# Altium project ECE295 Test Board.PrjPcb
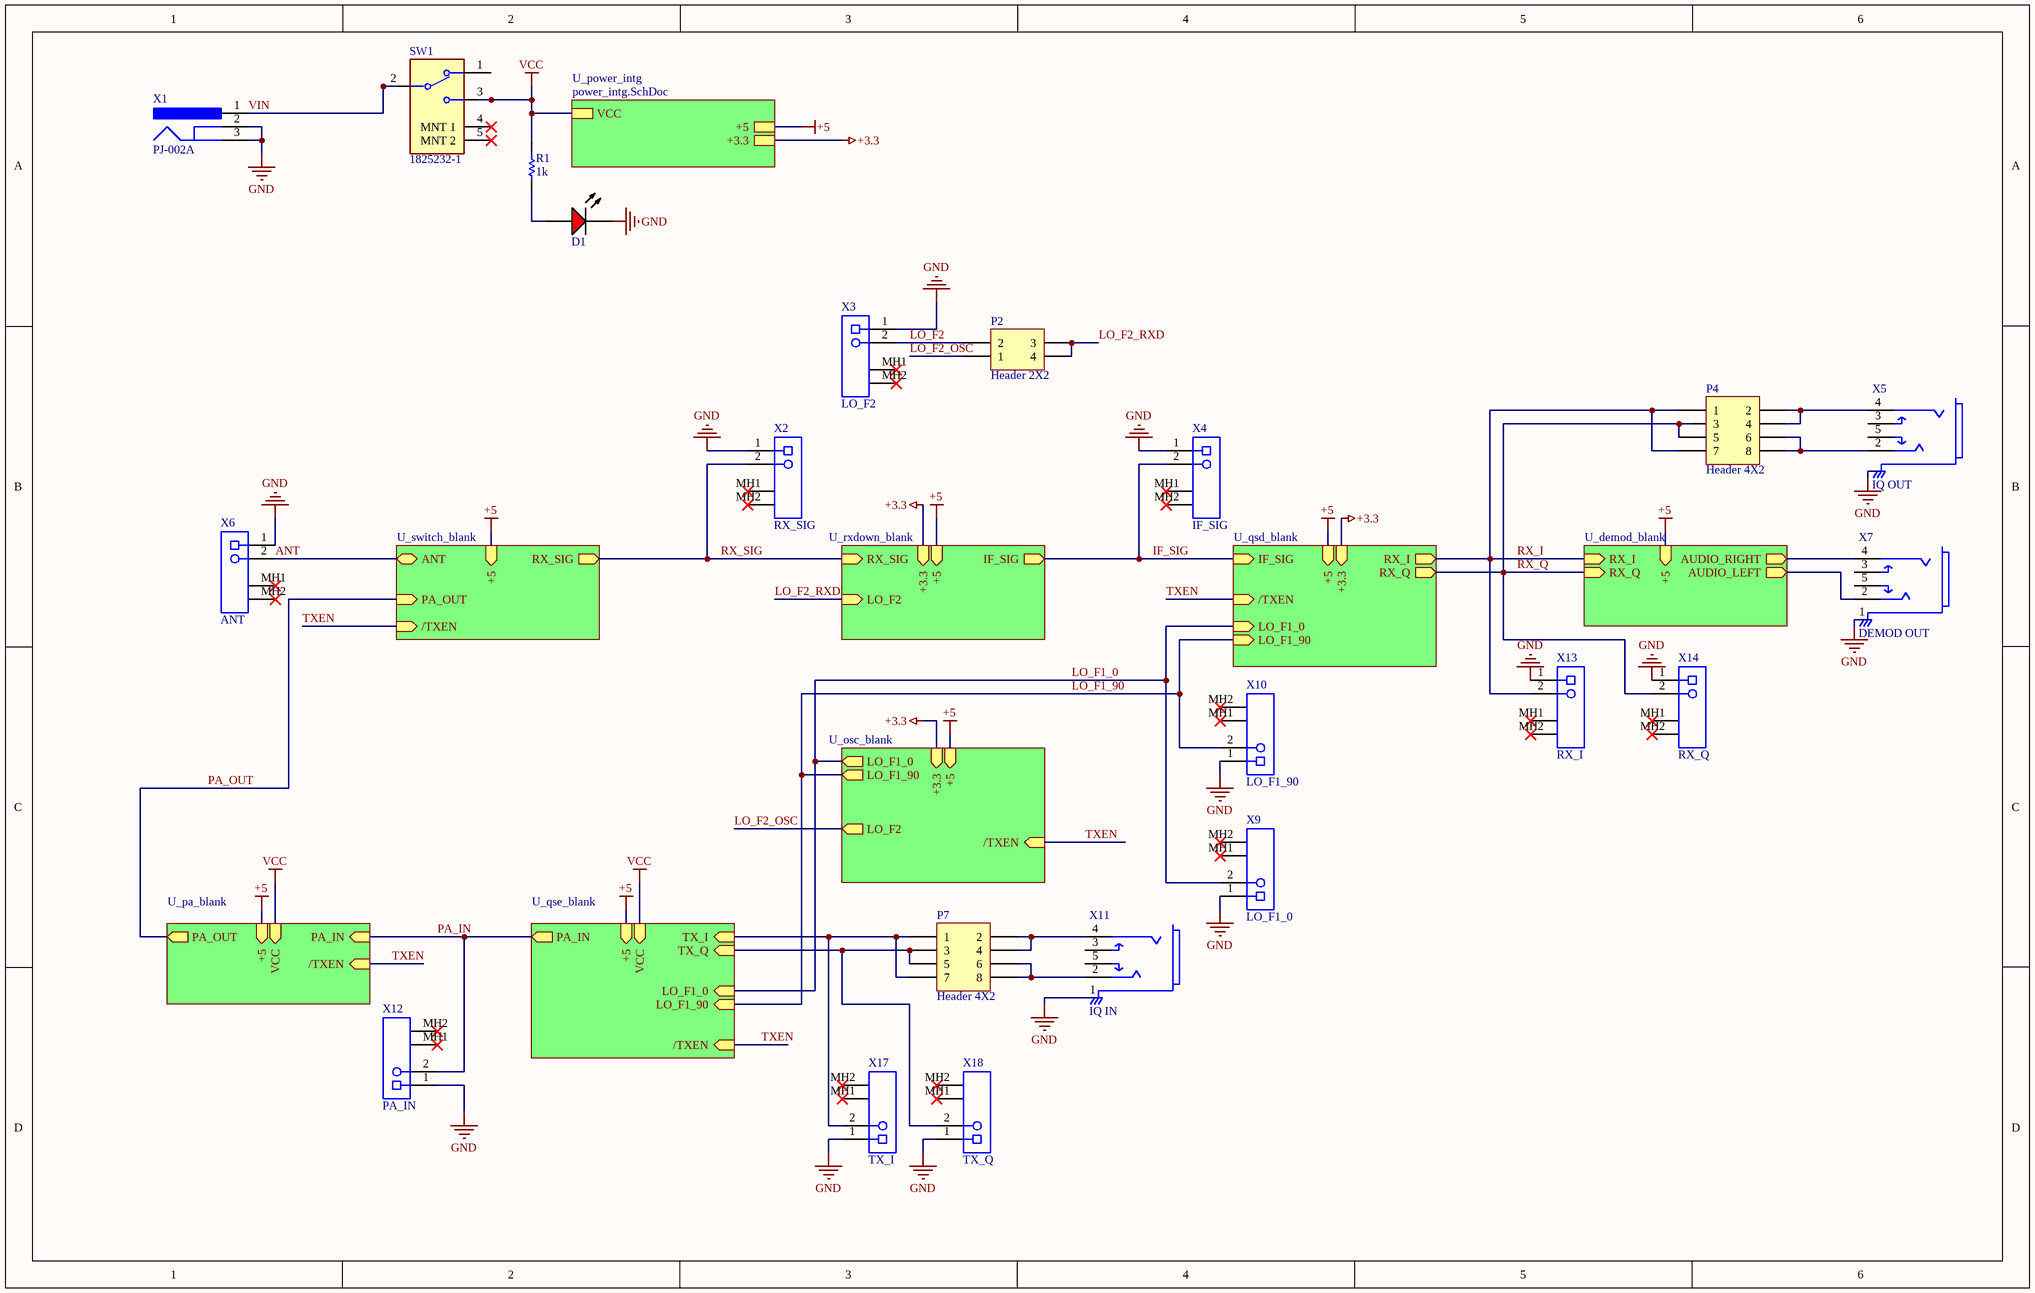
[diagram p0: top_blank.SchDoc]
9 sheets, 48 parts. Net scope: hierarchical (ports join the sheet entries above them; power ports are global).
Board files: top_blank.PcbDoc, demod_blank.PcbDoc, qsd_blank.PcbDoc, qse_blank.PcbDoc, rxdown_blank.PcbDoc, pa_blank.PcbDoc, switch_blank.PcbDoc, osc_blank.PcbDoc
Sheets:
  top_blank.SchDoc
    U_switch_blank = switch_blank.SchDoc
    U_rxdown_blank = rxdown_blank.SchDoc
    U_qsd_blank = qsd_blank.SchDoc
    U_demod_blank = demod_blank.SchDoc
    U_osc_blank = osc_blank.SchDoc
    U_pa_blank = pa_blank.SchDoc
    U_qse_blank = qse_blank.SchDoc
    U_power_intg = power_intg.SchDoc

## Sheet top_blank.SchDoc
size 381 x 241 mm; SheetNumber: 1; SheetTotal: 9

### Parts
D1  HLMP-3301  [AVAG-HLMP-3301-2]  (value not drawn)
P2  Header 2X2  [HDR2X2]
P4  Header 4X2  [HDR2X4]
P7  Header 4X2  [HDR2X4]
R1  value 1k  [AXIAL-0.4]  (hidden comment: Res1)
SW1  1825232-1  [FP-1825232-1-MFG]
X1  PJ-002A  [CUI-PJ-002A_V]
X2  RX_SIG  [TECO-1-1337543-0_V]
X3  LO_F2  [TECO-1-1337543-0_V]
X4  IF_SIG  [TECO-1-1337543-0_V]
X5  IQ OUT  [FP-35RAPC4BV4-MFG]
X6  ANT  [TECO-1-1337543-0_V]
X7  DEMOD OUT  [FP-35RAPC4BV4-MFG]
X9  LO_F1_0  [TECO-1-1337543-0_V]
X10  LO_F1_90  [TECO-1-1337543-0_V]
X11  IQ IN  [FP-35RAPC4BV4-MFG]
X12  PA_IN  [TECO-1-1337543-0_V]
X13  RX_I  [TECO-1-1337543-0_V]
X14  RX_Q  [TECO-1-1337543-0_V]
X17  TX_I  [TECO-1-1337543-0_V]
X18  TX_Q  [TECO-1-1337543-0_V]

### Sub-sheets
U_demod_blank = demod_blank.SchDoc: AUDIO_LEFT (out), AUDIO_RIGHT (out), +5 (in), RX_Q (in), RX_I (in)
U_osc_blank = osc_blank.SchDoc: /TXEN (in), LO_F1_0 (out), LO_F1_90 (out), LO_F2 (out), +5 (in), +3.3 (in)
U_pa_blank = pa_blank.SchDoc: PA_IN (in), PA_OUT (out), /TXEN (in), +5 (in), VCC (in)
U_power_intg = power_intg.SchDoc: VCC, +3.3, +5
U_qsd_blank = qsd_blank.SchDoc: RX_I (out), RX_Q (out), IF_SIG (in), /TXEN (in), LO_F1_90 (in), LO_F1_0 (in), +5 (in), +3.3 (in)
U_qse_blank = qse_blank.SchDoc: TX_I (in), TX_Q (in), /TXEN (in), LO_F1_0 (in), LO_F1_90 (in), PA_IN (out), VCC (in), +5 (in)
U_rxdown_blank = rxdown_blank.SchDoc: IF_SIG (out), +5 (in), +3.3 (in), LO_F2 (in), RX_SIG (in)
U_switch_blank = switch_blank.SchDoc: ANT (bidir), RX_SIG (out), PA_OUT (in), /TXEN (in), +5 (in)

### Nets
+3.3: sheet U_rxdown_blank/+3.3, sheet U_qsd_blank/+3.3, sheet U_osc_blank/+3.3, sheet U_power_intg/+3.3
+5: sheet U_switch_blank/+5, sheet U_rxdown_blank/+5, sheet U_qsd_blank/+5, sheet U_demod_blank/+5, sheet U_osc_blank/+5, sheet U_pa_blank/+5, sheet U_qse_blank/+5, sheet U_power_intg/+5
GND: D1.1(K) X1.2 X1.3 X2.1 X3.1 X4.1 X5.1 X6.1 X7.1 X9.1 X10.1 X11.1 X12.1 X13.1 X14.1 X17.1 X18.1
VCC: R1.2 SW1.3 ; sheet U_pa_blank/VCC, sheet U_qse_blank/VCC, sheet U_power_intg/VCC
ANT: X6.2 ; sheet U_switch_blank/ANT
IF_SIG: X4.2 ; sheet U_rxdown_blank/IF_SIG, sheet U_qsd_blank/IF_SIG
LO_F1_0: X9.2 ; sheet U_qsd_blank/LO_F1_0, sheet U_osc_blank/LO_F1_0, sheet U_qse_blank/LO_F1_0
LO_F1_90: X10.2 ; sheet U_qsd_blank/LO_F1_90, sheet U_osc_blank/LO_F1_90, sheet U_qse_blank/LO_F1_90
LO_F2: P2.2 X3.2
LO_F2_OSC: P2.1 ; sheet U_osc_blank/LO_F2
LO_F2_RXD: P2.3 P2.4 ; sheet U_rxdown_blank/LO_F2
PA_IN: X12.2 ; sheet U_pa_blank/PA_IN, sheet U_qse_blank/PA_IN
PA_OUT: sheet U_switch_blank/PA_OUT, sheet U_pa_blank/PA_OUT
RX_I: P4.1 P4.7 X13.2 ; sheet U_qsd_blank/RX_I, sheet U_demod_blank/RX_I
RX_Q: P4.3 P4.5 X14.2 ; sheet U_qsd_blank/RX_Q, sheet U_demod_blank/RX_Q
RX_SIG: X2.2 ; sheet U_switch_blank/RX_SIG, sheet U_rxdown_blank/RX_SIG
TXEN: sheet U_switch_blank//TXEN, sheet U_qsd_blank//TXEN, sheet U_osc_blank//TXEN, sheet U_pa_blank//TXEN, sheet U_qse_blank//TXEN
VIN: SW1.2 X1.1
NetD1_2: D1.2(A) R1.1
NetJ8_1: X7.4 ; sheet U_demod_blank/AUDIO_RIGHT
NetJ8_2: X7.2 ; sheet U_demod_blank/AUDIO_LEFT
NetJ14_1: P7.1 P7.7 X17.2 ; sheet U_qse_blank/TX_I
NetJ14_2: P7.3 P7.5 X18.2 ; sheet U_qse_blank/TX_Q
NetP4_2: P4.2 P4.4 X5.4
NetP4_6: P4.6 P4.8 X5.2
NetP7_2: P7.2 P7.4 X11.4
NetP7_6: P7.6 P7.8 X11.2

Not connected (* = marked no-connect by the designer): SW1 1 4(MNT_1)* 5(MNT_2)*; X2 MH1* MH2*; X3 MH1* MH2*; X4 MH1* MH2*; X5 3 5; X6 MH1* MH2*; X7 3 5; X9 MH1* MH2*; X10 MH1* MH2*; X11 3 5; X12 MH1* MH2*; X13 MH1* MH2*; X14 MH1* MH2*; X17 MH1* MH2*; X18 MH1* MH2*

### Library data of the parts
D1 = CMP-2000-06411-1: T-1 3/4 (5 mm) Diffused LED Lamp, 1.9 V, -40 to 100 degC, 2-Pin THD, RoHS, Bulk; Manufacturer: Avago; Forward Current: 25mA; Forward Voltage: 2.4V; Peak Wavelength: 635nm; Shape Type: Circular; High Brightness: No; Main Category: StandardLED; Test Current (It): 10mA; Dominant Wave Length: 626nm; Number of  Elements: 1; Reverse Voltage: 5V; Chip Material: GaP; Product Height (mm): 9.19mm; Lens Type: ColoredDiffused; Viewing Angle: 60deg; Type: Uni-Color; Emitting Color: Red; Luminous Intensity: 5.4mcd; Power Dissipation: 85W; DELETED: Compliant; Product Depth (mm): 6.1mm; Package Description: 2-Pin Through Hole LED, Dia 5.85 mm; Mounting Technology: ThroughHole; Manufacturer URL: http://www.avagotech.com/; Package Type: T-13/4; Operating Temp Range: -40Cto100C; Datasheet URL: http://www.avagotech.com/docs/AV02-1558EN; Mounting: ThroughHole; Lens Dimensions: 5.08x5.08x8.3mm; Package Reference: HLMP-3301; Datasheet Version: 03/2015; Pin Count: 2; Packaging: TapeandReel; Operating Temperature Classification: Industrial; Lum Intensity: 5.4mcd; Rad Hardened: No; Product Length (mm): 6.1mm
P2 = Header 2X2: Header, 2-Pin, Dual row; LatestRevisionDate: 17-Jul-2002; LatestRevisionNote: Re-released for DXP Platform.; Publisher: Altium Limited
P4 P7 = Header 4X2: Header, 4-Pin, Dual row; LatestRevisionDate: 17-Jul-2002; LatestRevisionNote: Re-released for DXP Platform.; Publisher: Altium Limited
R1 = Res1: Resistor; Published: 8-Jun-2000; LatestRevisionDate: 17-Jul-2002; LatestRevisionNote: Re-released for DXP Platform.; PackageReference: AXIAL-0.3; Publisher: Altium Limited; PackageDescription: Axial Device, Thru-Hole; 2 Leads; 0.3 in Pin Spacing
SW1 = CMP-03405-000001-1: SWITCH SLIDE SPDT 200MA 30V; Manufacturer: TE Connectivity; Contact Current Rating: 0.2A; Contact Resistance: 20mΩ; Electromechanical Life: 10000Cycles; Operating Force: 200gf; Throw Configuration: SPDT; Manufacturer Part Number: 1825232-1; Temperature Range High: +70°C; Height: 3.7mm; ComponentLink2URL: https://www.te.com/commerce/DocumentDelivery/DDEController?Action=showdoc&DocId=Customer+Drawing%7F1825232%7FB2%7Fpdf%7FEnglish%7FENG_CD_1825232_B2.pdf%7F1825232-1; Mount: Through Hole; Mouser Description: Slide Switches SLIDE SWITCH SPDT Right Angle; Package: 1825232-1; Temperature: -20°C to +70°C; Automotive: No; ComponentLink2Description: Datasheet; Lead Free: Yes; Octopart: https://octopart.com/1825232-1-te+connectivity-45209882; Device Class L1: Electromechanical; Digikey Description: SWITCH SLIDE SPDT 200MA 30V; Device Class L3: Slide Switches; Device Class L2: Switches; Voltage Rating Dc: 30V; Temperature Range Low: -20°C; Category: Switch; RoHS: TRUE
X1 = CMP-2000-06895-1: Through Hole Right Angle DC Power Jack, 2.5 A, 2 mm Center Pin, 3 Position, -25 to 85 degC, RoHS, Bulk; Manufacturer: CUIInc.; Current Rating: 2.5A; Inside Contact Diameter: 2mm; Insulation Resistance: 50MOhms; Outside Contact Diameter: 6.5mm; Voltage Rating: 24V; Brand: CUI; Operating Temperature Range: -25Cto+85C; Mounting Technology: ThroughHole; Connector Type: DCPowerJack; Contact Material: Copper; Datasheet URL: http://www.cui.com/product/resource/pj-002a.pdf; Contact Gender: Male; Housing Material: PolybutyleneTerephthalate(PBT); Manufacturer URL: http://www.cui.com/; Package Reference: PJ-002A; Mounting Style: ThroughHole; Mounting Angle: Right; Product Category: DCPowerConnectors; Product: Jacks; Flammability Rating: UL94V-0; Contact Plating: Nickel; RoHS: True; Datasheet Version: Rev. 1.03, 04/2016; Package Description: 3-Pin Through Hole Device, Body 14.4 x 9 mm, Height 11 mm; Factory Pack Quantity: 500; Termination Style: ThroughHole
X2-X4 X6 X9 X10 X12-X14 X17 X18 = CMP-2000-05853-1: Female Connector, Pitch 2.54 mm, 1 x 2 Position, Height 15.8 mm, Tail Length 3.8 mm, / -55 to 85 degC, RoHS, Bulk; Manufacturer: TE Connectivity; Connector Body Style: RightAngleJack; Frequency Max: 4GHz; Coaxial Termination: Solder; Connector Mounting: PCBMount; SVHC: ToBeAdvised; Connector Type: BNCCoaxial; Impedance: 50ohm; Coaxial Cable Types: -; Manufacturer URL: http://www.te.com/; Package Reference: 1-1337543-0; Product Range: -; Datasheet URL: http://www.te.com/commerce/DocumentDelivery/DDEController?Action=showdoc&DocId=Customer+Drawing%7F1337543%7FG%7Fpdf%7FEnglish%7FENG_CD_1337543_G.pdf%7F1-1337543-0; Contact Plating: GoldPlatedContacts; Mounting Technology: ThroughHole; Package Description: Female Connector, Pitch 2.54 mm, 1 x 2 Position, Height 15.8 mm, Tail Length 3.8 mm; Contact Material: Brass; Datasheet Version: Rev. G, 12/2012
X5 X7 X11 = CMP-47983-000001-1: CONN JACK STEREO 3.5MM R/A; Manufacturer: Switchcraft; Obsolete Part: true; Manufacturer Part Number: 35RAPC4BV4; Conn Orientation: Right Angle; Number Of Contacts: 5; Contact Material: Silver; Device Class L1: Connectors; Height: 0.495inch; ComponentLink2URL: http://www.switchcraft.com/Drawings/35rapc__v4_cd.pdf; Category: Conn; Digikey Description: CONN JACK STEREO 3.5MM R/A; Automotive: No; ComponentLink2Description: Datasheet; Package: 35RAPC4BV4; Device Class L2: Audio / Video Connectors; Mouser Description: Phone Connectors 3.5MM VERT STEREO JK; RoHS: TRUE; Octopart: https://octopart.com/35rapc4bv4-switchcraft-223606; Lead Free: Yes; Device Class L3: unset

## Sheet switch_blank.SchDoc
size Letter; SheetNumber: 8; SheetTotal: 9
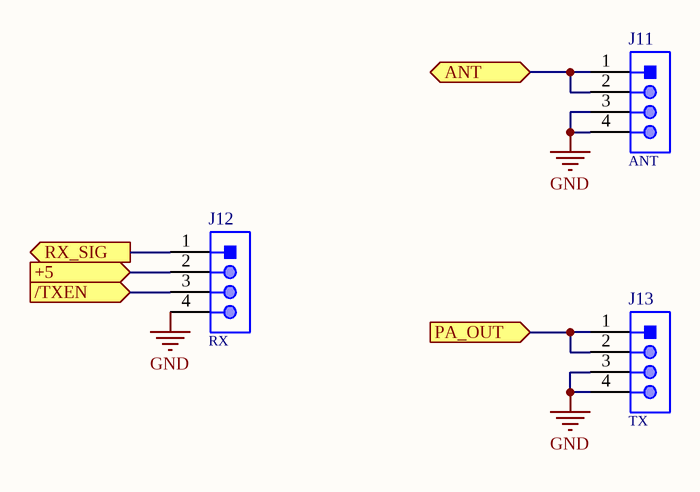
[diagram p1: switch_blank.SchDoc]

### Parts
J11  ANT  [61300411121]
J12  RX  [61300411121]
J13  TX  [61300411121]

### Ports
+5 (in), /TXEN (in), ANT (bidir), PA_OUT (in), RX_SIG (out)

### Nets
+5: J12.2 ; port +5
GND: J11.3 J11.4 J12.4 J13.3 J13.4
ANT: J11.1 J11.2 ; port ANT
PA_OUT: J13.1 J13.2 ; port PA_OUT
RX_SIG: J12.1 ; port RX_SIG
TXEN: J12.3 ; port /TXEN

### Library data of the parts
J11-J13 = CMP-1502-01064-1: THT Vertical Pin Header WR-PHD, Pitch 2.54 mm, Single Row, 4 pins; Manufacturer: Wurth Elektronik; Withstanding Voltage: 500VAC; Rated Current: 3A; Working Voltage: 250VAC; Pin Number: 4; Gender: Male; Contact Resistance: 20mOhm; Pitch: 2.54mm; Manufacturer URL: http://www.we-online.de; Operating Temperature: -40to105degC; Packaging: Bag; Mounting Technology: THT; Package Reference: 61300411121; Datasheet URL: https://katalog.we-online.de/em/datasheet/6130xx11121.pdf; Publisher: WurthElektronik; Part Number: 61300411121; Row Number: Single; Orientation: Vertical

## Sheet rxdown_blank.SchDoc
size Letter; SheetNumber: 9; SheetTotal: 9
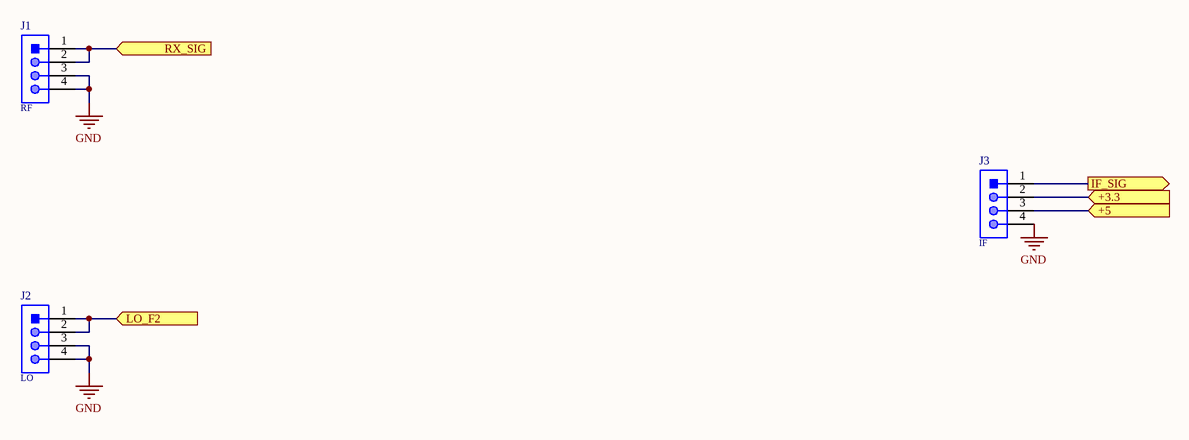
[diagram p2: rxdown_blank.SchDoc]

### Parts
J1  RF  [61300411121]
J2  LO  [61300411121]
J3  IF  [61300411121]

### Ports
+3.3 (in), +5 (in), IF_SIG (out), LO_F2 (in), RX_SIG (in)

### Nets
+3.3: J3.2 ; port +3.3
+5: J3.3 ; port +5
GND: J1.3 J1.4 J2.3 J2.4 J3.4
IF_SIG: J3.1 ; port IF_SIG
LO_F2_RXD: J2.1 J2.2 ; port LO_F2
RX_SIG: J1.1 J1.2 ; port RX_SIG

### Library data of the parts
J1-J3 = CMP-1502-01064-1: as J11 on sheet switch_blank; Manufacturer URL: http://www.we-online.de; Operating Temperature: -40to105degC; Packaging: Bag; Mounting Technology: THT; Package Reference: 61300411121; Datasheet URL: https://katalog.we-online.de/em/datasheet/6130xx11121.pdf; Publisher: WurthElektronik; Part Number: 61300411121; Row Number: Single; Orientation: Vertical

## Sheet qsd_blank.SchDoc
size Letter; SheetNumber: 7; SheetTotal: 9
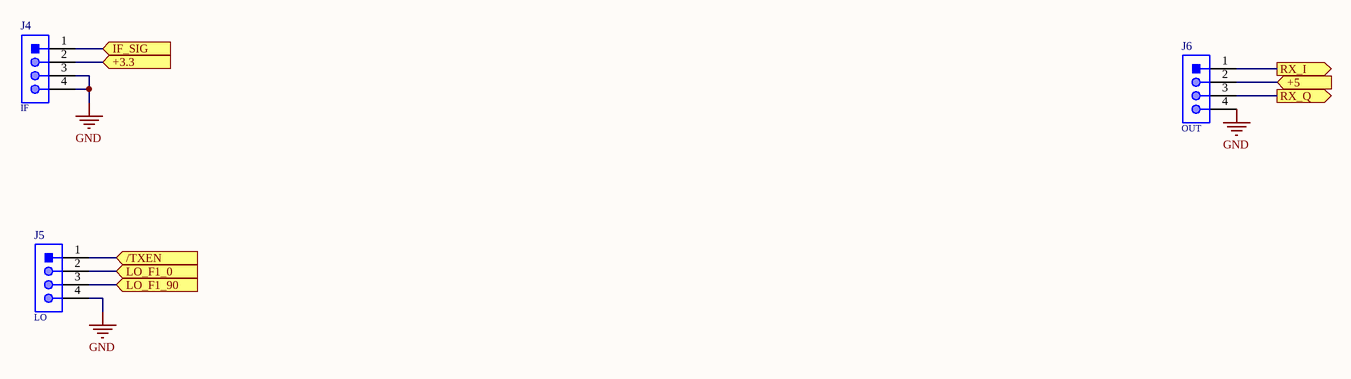
[diagram p3: qsd_blank.SchDoc]

### Parts
J4  IF  [61300411121]
J5  LO  [61300411121]
J6  OUT  [61300411121]

### Ports
+3.3 (in), +5 (in), /TXEN (in), IF_SIG (in), LO_F1_0 (in), LO_F1_90 (in), RX_I (out), RX_Q (out)

### Nets
+3.3: J4.2 ; port +3.3
+5: J6.2 ; port +5
GND: J4.3 J4.4 J5.4 J6.4
IF_SIG: J4.1 ; port IF_SIG
LO_F1_0: J5.2 ; port LO_F1_0
LO_F1_90: J5.3 ; port LO_F1_90
RX_I: J6.1 ; port RX_I
RX_Q: J6.3 ; port RX_Q
TXEN: J5.1 ; port /TXEN

### Library data of the parts
J4-J6 = CMP-1502-01064-1: as J11 on sheet switch_blank; Manufacturer URL: http://www.we-online.de; Operating Temperature: -40to105degC; Packaging: Bag; Mounting Technology: THT; Package Reference: 61300411121; Datasheet URL: https://katalog.we-online.de/em/datasheet/6130xx11121.pdf; Publisher: WurthElektronik; Part Number: 61300411121; Row Number: Single; Orientation: Vertical

## Sheet demod_blank.SchDoc
size Letter; SheetNumber: 13; SheetTotal: 13
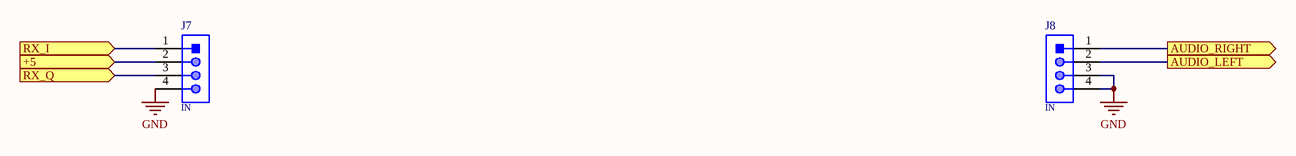
[diagram p4: demod_blank.SchDoc]

### Parts
J7  IN  [61300411121]
J8  IN  [61300411121]

### Ports
+5 (in), AUDIO_LEFT (out), AUDIO_RIGHT (out), RX_I (in), RX_Q (in)

### Nets
+5: J7.2 ; port +5
GND: J7.4 J8.3 J8.4
RX_I: J7.1 ; port RX_I
RX_Q: J7.3 ; port RX_Q
NetJ8_1: J8.1 ; port AUDIO_RIGHT
NetJ8_2: J8.2 ; port AUDIO_LEFT

### Library data of the parts
J7 J8 = CMP-1502-01064-1: as J11 on sheet switch_blank; Manufacturer URL: http://www.we-online.de; Operating Temperature: -40to105degC; Packaging: Bag; Mounting Technology: THT; Package Reference: 61300411121; Datasheet URL: https://katalog.we-online.de/em/datasheet/6130xx11121.pdf; Publisher: WurthElektronik; Part Number: 61300411121; Row Number: Single; Orientation: Vertical

## Sheet osc_blank.SchDoc
size Letter; SheetNumber: 5; SheetTotal: 9
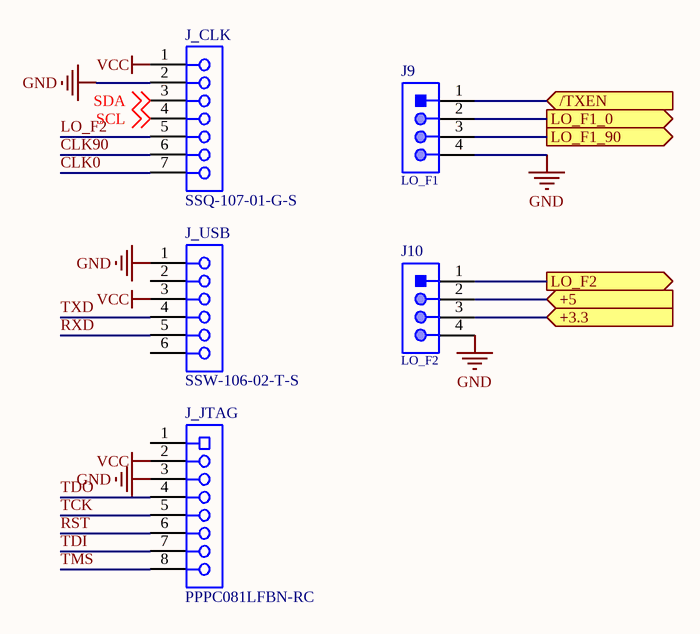
[diagram p5: osc_blank.SchDoc]

### Parts
J9  LO_F1  [61300411121]
J10  LO_F2  [61300411121]
J_CLK  SSQ-107-01-G-S  [SMTC-SSQ-107-01-X-S]
J_JTAG  PPPC081LFBN-RC  [SLIN-PPPC081LFBN-RC_V]
J_USB  SSW-106-02-T-S  [SMTC-SSW-106-02-X-S]

### Ports
+3.3 (in), +5 (in), /TXEN (in), LO_F1_0 (out), LO_F1_90 (out), LO_F2 (out)

### Nets
+3.3: J10.3 ; port +3.3
+5: J10.2 ; port +5
GND: J9.4 J10.4 J_CLK.2 J_JTAG.3 J_USB.1
VCC: J_CLK.1 J_JTAG.2 J_USB.3
CLK0: J_CLK.7
CLK90: J_CLK.6
LO_F1_0: J9.2 ; port LO_F1_0
LO_F1_90: J9.3 ; port LO_F1_90
LO_F2: J_CLK.5
LO_F2_OSC: J10.1 ; port LO_F2
RST: J_JTAG.6
RXD: J_USB.5
SCL: J_CLK.4 ; off-sheet SCL
SDA: J_CLK.3 ; off-sheet SDA
TCK: J_JTAG.5
TDI: J_JTAG.7
TDO: J_JTAG.4
TMS: J_JTAG.8
TXD: J_USB.4
TXEN: J9.1 ; port /TXEN

Not connected (* = marked no-connect by the designer): J_JTAG 1; J_USB 2 6

### Library data of the parts
J9 J10 = CMP-1502-01064-1: as J11 on sheet switch_blank; Manufacturer URL: http://www.we-online.de; Operating Temperature: -40to105degC; Packaging: Bag; Mounting Technology: THT; Package Reference: 61300411121; Datasheet URL: https://katalog.we-online.de/em/datasheet/6130xx11121.pdf; Publisher: WurthElektronik; Part Number: 61300411121; Row Number: Single; Orientation: Vertical
J_CLK = CMP-1023-00284-1: SQ Post Socket, Through-hole, Vertical, -55 to 125 degC, 2.54 mm Pitch, 7-Pin, Female, RoHS; Manufacturer: Samtec; Pitch: 2.54 mm; PackageDescription: Assembly, Socket Strip .025[0.64] SQ Tail; PartNumber: SSQ-107-01-G-S; PackageReference: SSQ-107-01-X-S; ComponentLink2URL: http://www.samtec.com/documents/webfiles/pdf/SSQ_TH.PDF; ComponentLink1URL: http://www.samtec.com; ComponentLink3Description: Package Specification; PackageVersion: BD, 6/1987; RoHS: True; DatasheetVersion: F-214; Mounting Technology: Through-hole; ComponentLink3URL: http://www.samtec.com/documents/webfiles/cpdf/SSQ-1XX-XX-XXX-X-XX-XXX-XX-X-MKT.pdf; ComponentLink1Description: Manufacturer URL; Temperature Range: -55 to 125 degC; Orientation: Vertical; ComponentLink2Description: Datasheet
J_JTAG = CMP-1770-00002-1: Female Header, Pitch 2.54 mm, 1 x 8 Position, Height 8.5 mm, Tail Length 3.2 mm, -40 to 105 degC, RoHS, Bulk; Case\Package: TO-252-3; Rds On Max: 115 mohm; Typical Rise Time: 90 ns; Max Power Dissipation: 2.5 W; Input Capacitance: 350 pF; Elements: 1; Height: 2.39 mm; Min Operating Temperature: -55 degC; RoHSCompliant: true; PackageDescription: Female Header, Pitch 2.54 mm, 1 x 8 Position, Height 8.5 mm, Tail Length 3.2 mm; Length: 6.73 mm; ComponentLink1Description: Datasheet; Package Quantity: 2500; Max Operating Temperature: 150 degC; Width: 6.22 mm; Radiation Hardening: No; Packaging: Tape and Reel; REACH SVHC: No SVHC; Pins: 3; PackageReference: PPPC081LFBN-RC; ComponentLink1URL: http://sullinscorp.com/catalogs/101_PAGE114-115_.100_FEMALE_HDR.pdf; DatasheetVersion: Jan-15; Mount: Surface Mount
J_USB = CMP-1023-00360-1: SQ Post Socket, Through-hole, Vertical, -55 to 105 degC, 2.54mm Pitch, 6-Pin, Female, RoHS; Manufacturer: Samtec; ComponentLink1URL: http://www.samtec.com; Temperature Range: -55 to 105 degC; Pitch: 2.54 mm; Mounting Technology: Through-hole; DatasheetVersion: F-214; ComponentLink1Description: Manufacturer URL; PackageVersion: CA, 6/1987; ComponentLink3Description: Package Specification; PackageDescription: Assembly, Socket Strip .016 X .031 Tail; ComponentLink2Description: Datasheet; ComponentLink2URL: http://www.samtec.com/documents/webfiles/pdf/SSW_TH.PDF; PackageReference: SSW-106-02-X-S; ComponentLink3URL: http://www.samtec.com/documents/webfiles/cpdf/SSW-1XX-XX-XXX-X-XX-XXX-XX-MKT.pdf; RoHS: True; PartNumber: SSW-106-02-T-S; Orientation: Vertical

## Sheet pa_blank.SchDoc
size Letter; SheetNumber: 16; SheetTotal: 16
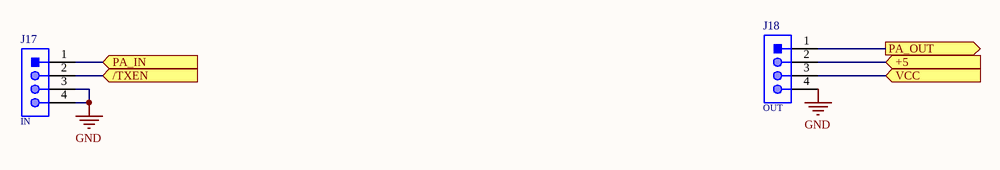
[diagram p6: pa_blank.SchDoc]

### Parts
J17  IN  [61300411121]
J18  OUT  [61300411121]

### Ports
+5 (in), /TXEN (in), PA_IN (in), PA_OUT (out), VCC (in)

### Nets
+5: J18.2 ; port +5
GND: J17.3 J17.4 J18.4
VCC: J18.3 ; port VCC
PA_IN: J17.1 ; port PA_IN
PA_OUT: J18.1 ; port PA_OUT
TXEN: J17.2 ; port /TXEN

### Library data of the parts
J17 J18 = CMP-1502-01064-1: as J11 on sheet switch_blank; Manufacturer URL: http://www.we-online.de; Operating Temperature: -40to105degC; Packaging: Bag; Mounting Technology: THT; Package Reference: 61300411121; Datasheet URL: https://katalog.we-online.de/em/datasheet/6130xx11121.pdf; Publisher: WurthElektronik; Part Number: 61300411121; Row Number: Single; Orientation: Vertical

## Sheet qse_blank.SchDoc
size Letter; SheetNumber: 4; SheetTotal: 9
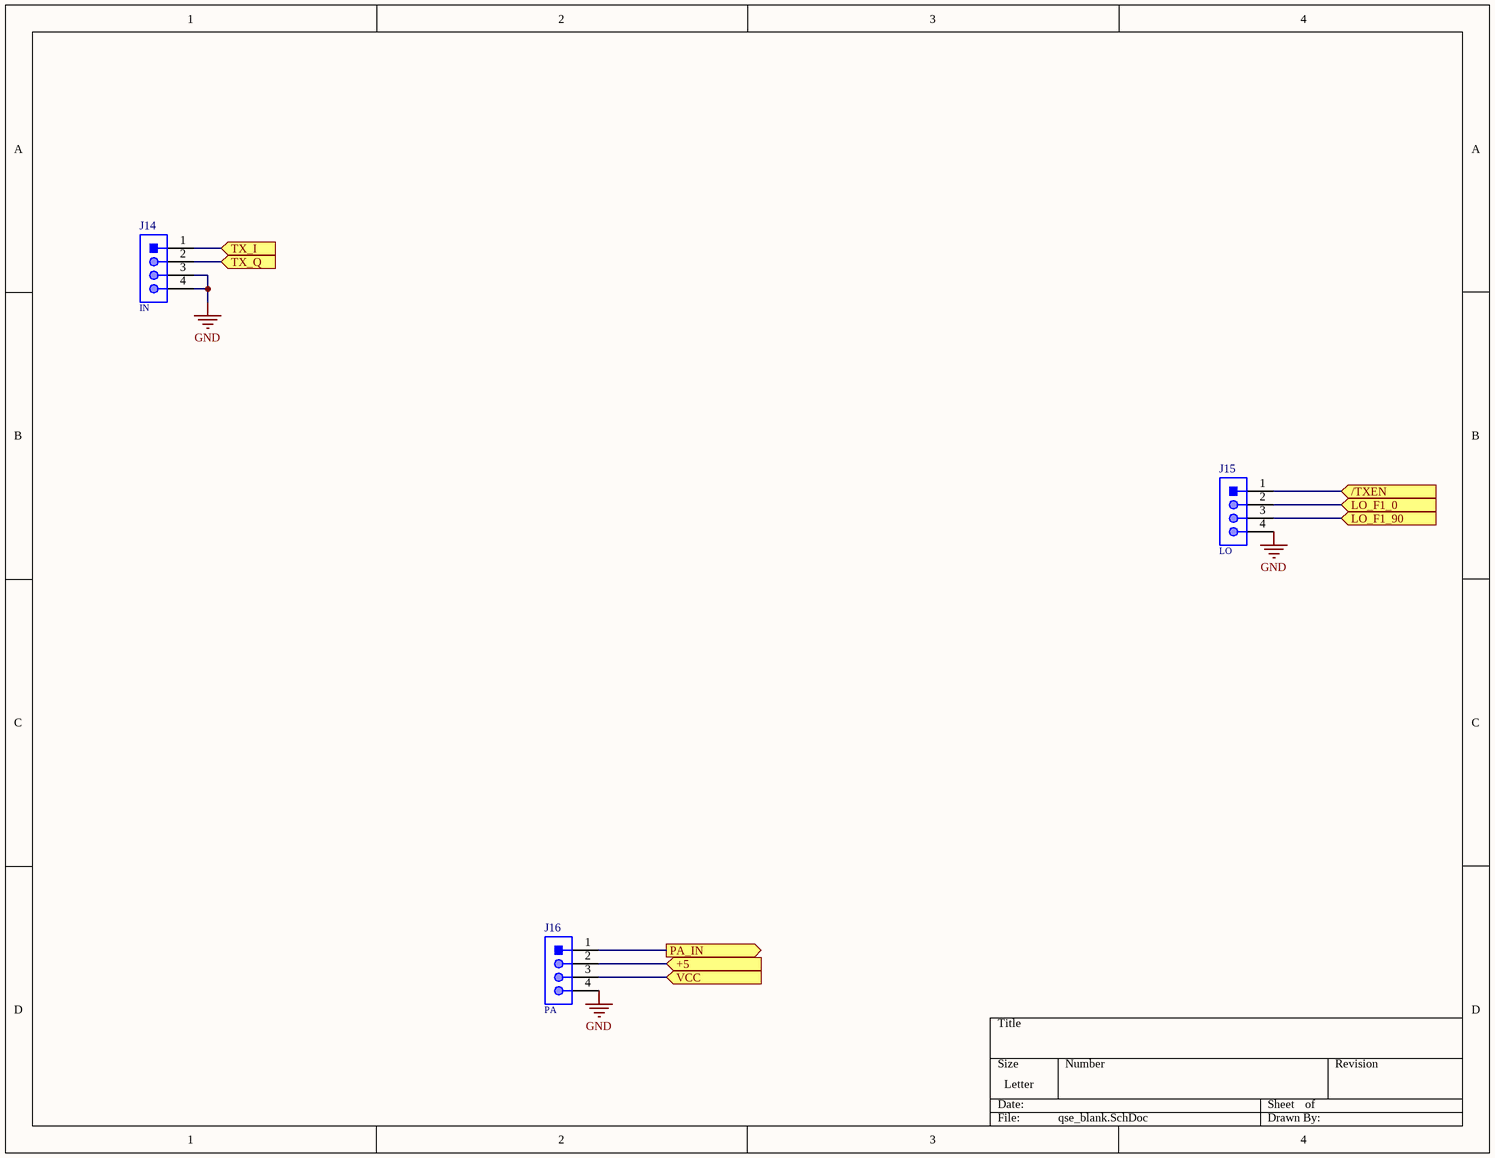
[diagram p7: qse_blank.SchDoc]

### Parts
J14  IN  [61300411121]
J15  LO  [61300411121]
J16  PA  [61300411121]

### Ports
+5 (in), /TXEN (in), LO_F1_0 (in), LO_F1_90 (in), PA_IN (out), TX_I (in), TX_Q (in), VCC (in)

### Nets
+5: J16.2 ; port +5
GND: J14.3 J14.4 J15.4 J16.4
VCC: J16.3 ; port VCC
LO_F1_0: J15.2 ; port LO_F1_0
LO_F1_90: J15.3 ; port LO_F1_90
PA_IN: J16.1 ; port PA_IN
TXEN: J15.1 ; port /TXEN
NetJ14_1: J14.1 ; port TX_I
NetJ14_2: J14.2 ; port TX_Q

### Library data of the parts
J14-J16 = CMP-1502-01064-1: as J11 on sheet switch_blank; Manufacturer URL: http://www.we-online.de; Operating Temperature: -40to105degC; Packaging: Bag; Mounting Technology: THT; Package Reference: 61300411121; Datasheet URL: https://katalog.we-online.de/em/datasheet/6130xx11121.pdf; Publisher: WurthElektronik; Part Number: 61300411121; Row Number: Single; Orientation: Vertical

## Sheet power_intg.SchDoc
size Letter
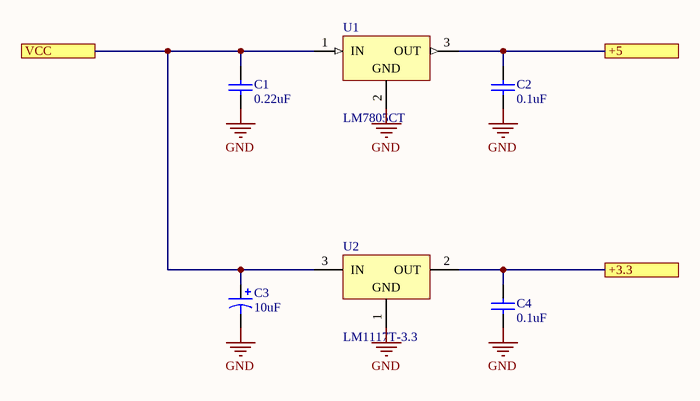
[diagram p8: power_intg.SchDoc]

### Parts
C1  value 0.22uF  [RAD-0.1]  (hidden comment: Cap)
C2  value 0.1uF  [RAD-0.1]  (hidden comment: Cap)
C3  value 10uF  [RAD-0.1]  (hidden comment: Cap Pol1)
C4  value 0.1uF  [RAD-0.1]  (hidden comment: Cap)
U1  LM7805CT  [FAIR-TO-220-3]
U2  LM1117T-3.3  [T03B]

### Ports
+3.3, +5, VCC

### Nets
+3.3: C4.1 U2.2(OUT) ; port +3.3
+5: C2.1 U1.3(OUT) ; port +5
GND: C1.2 C2.2 C3.2 C4.2 U1.2(GND) U2.1(GND)
VCC: C1.1 C3.1 U1.1(IN) U2.3(IN) ; port VCC

### Library data of the parts
C1 C2 C4 = Cap: Capacitor; Published: 8-Jun-2000; LatestRevisionDate: 17-Jul-2002; LatestRevisionNote: Re-released for DXP Platform.; PackageReference: RAD-0.3; Publisher: Altium Limited; PackageDescription: Radial Cap, Thru-Hole; 2 Leads; 0.3 in Pin Spacing
C3 = Cap Pol1: Polarized Capacitor (Radial); Published: 8-Jun-2000; LatestRevisionDate: 17-Jul-2002; LatestRevisionNote: Re-released for DXP Platform.; PackageReference: RB7.6-15; Publisher: Altium Limited; PackageDescription: Polarized Capacitor (Radial); 2 Leads
U1 = CMP-2000-04938-1: Positive Voltage Regulator, 5 V, 1 A, -40 to 125 degC, 3-Pin TO-220, RoHS, Tube; Manufacturer: FairchildSemiconductor; Maximum Input Voltage: 35V; Maximum Quiescent Current: 8mA; Load Regulation: 100mV; Maximum Output Current: 2.2(Typ)A; Output Type: Fixed; Typical Dropout Voltage @ Current: 2@1AV; Rad Hard: No; Output Voltage: 5V; Accuracy: ±4%; Number of Outputs: 1; Category: LinearRegulator; Package Description: 3-Pin Through Hole Device, Body 10 x 4.5 mm, Pitch 2.54 mm; Packaging: Rail/Tube; Mounting: ThroughHole; Polarity: Positive; Manufacturer URL: https://www.fairchildsemi.com/; Line Regulation: 100mV; Datasheet Version: Aug-12; Datasheet URL: https://datasheet.ciiva.com/26904/lm7805ct-26904988.pdf; Package Reference: TO-220; Package URL: https://www.fairchildsemi.com/package-drawings/TO/TO220B03.pdf; Package: 3TO-220AB; Operating Temperature: -40to125degC; Type: Linear
U2 = CMP-0062-02490-2: 800mA Low-Dropout Linear Regulator, 3-pin TO-220; Manufacturer: National Semiconductor; PowerWise: N; CompType: LDO IC; PackageTopMarking: NSUZXYTTE#*LM1117T*3.3; ComponentLink1Description: LM1117 Datasheet; RoHS: N; PinCount: 3; DatasheetVersion: Apr-2006; PackageDescription: TO-220, Molded, 3 Lead, Straight; ComponentLink2URL: http://www.national.com/pf/LM/LM1117.html; ComponentLink2Description: LM1117 Web Page; RevisionNote: Component URLs added; ComponentLink3Description: T03B Package Page; PackageReference: T03B; ComponentLink1URL: http://www.national.com/ds/LM/LM1117.pdf; PackageVersion: revL, Jan-1992; ComponentLink3URL: http://www.national.com/packaging/folders/t03b.html

## Nets that join several sheets
+3.3: rxdown_blank (J3.2), qsd_blank (J4.2), osc_blank (J10.3), power_intg (C4.1 U2.2)
+5: switch_blank (J12.2), rxdown_blank (J3.3), qsd_blank (J6.2), demod_blank (J7.2), osc_blank (J10.2), pa_blank (J18.2), qse_blank (J16.2), power_intg (C2.1 U1.3)
GND: top_blank (17 pins), switch_blank (5 pins), rxdown_blank (5 pins), qsd_blank (J4.3 J4.4 J5.4 J6.4), demod_blank (J7.4 J8.3 J8.4), osc_blank (5 pins), pa_blank (J17.3 J17.4 J18.4), qse_blank (J14.3 J14.4 J15.4 J16.4), power_intg (6 pins)
VCC: top_blank (R1.2 SW1.3), osc_blank (J_CLK.1 J_JTAG.2 J_USB.3), pa_blank (J18.3), qse_blank (J16.3), power_intg (C1.1 C3.1 U1.1 U2.3)
ANT: top_blank (X6.2), switch_blank (J11.1 J11.2)
IF_SIG: top_blank (X4.2), rxdown_blank (J3.1), qsd_blank (J4.1)
LO_F1_0: top_blank (X9.2), qsd_blank (J5.2), osc_blank (J9.2), qse_blank (J15.2)
LO_F1_90: top_blank (X10.2), qsd_blank (J5.3), osc_blank (J9.3), qse_blank (J15.3)
LO_F2_OSC: top_blank (P2.1), osc_blank (J10.1)
LO_F2_RXD: top_blank (P2.3 P2.4), rxdown_blank (J2.1 J2.2)
NetJ8_1: top_blank (X7.4), demod_blank (J8.1)
NetJ8_2: top_blank (X7.2), demod_blank (J8.2)
NetJ14_1: top_blank (P7.1 P7.7 X17.2), qse_blank (J14.1)
NetJ14_2: top_blank (P7.3 P7.5 X18.2), qse_blank (J14.2)
PA_IN: top_blank (X12.2), pa_blank (J17.1), qse_blank (J16.1)
PA_OUT: switch_blank (J13.1 J13.2), pa_blank (J18.1)
RX_I: top_blank (P4.1 P4.7 X13.2), qsd_blank (J6.1), demod_blank (J7.1)
RX_Q: top_blank (P4.3 P4.5 X14.2), qsd_blank (J6.3), demod_blank (J7.3)
RX_SIG: top_blank (X2.2), switch_blank (J12.1), rxdown_blank (J1.1 J1.2)
TXEN: switch_blank (J12.3), qsd_blank (J5.1), osc_blank (J9.1), pa_blank (J17.2), qse_blank (J15.1)